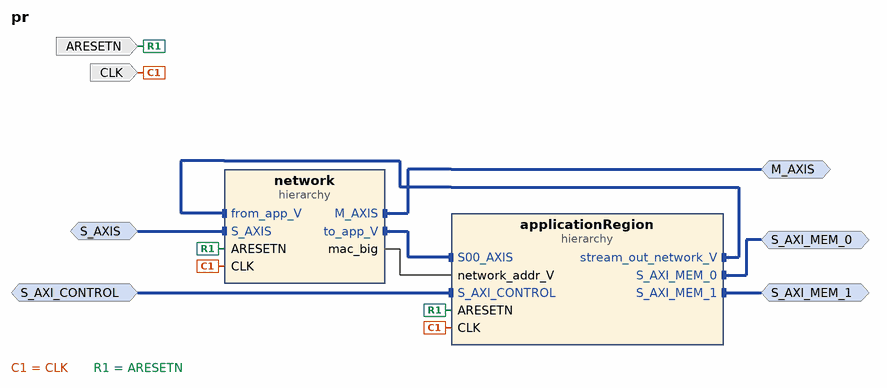
[diagram p0: block diagram of the top level]
# Vivado block design pr, xcku115-flva1517-2-e, Vivado 2018.2
create_bd_design pr

create_bd_intf_port -mode Slave -vlnv xilinx.com:interface:aximm_rtl:1.0 S_AXI_CONTROL
set_property -dict [list \
  CONFIG.DATA_WIDTH 32 \
  CONFIG.PROTOCOL AXI4LITE \
  CONFIG.FREQ_HZ 156250000 \
  CONFIG.ID_WIDTH 0 \
  CONFIG.ADDR_WIDTH 16 \
  CONFIG.AWUSER_WIDTH 0 \
  CONFIG.ARUSER_WIDTH 0 \
  CONFIG.WUSER_WIDTH 0 \
  CONFIG.RUSER_WIDTH 0 \
  CONFIG.BUSER_WIDTH 0 \
  CONFIG.READ_WRITE_MODE READ_WRITE \
  CONFIG.HAS_BURST 1 \
  CONFIG.HAS_LOCK 1 \
  CONFIG.HAS_PROT 1 \
  CONFIG.HAS_CACHE 1 \
  CONFIG.HAS_QOS 0 \
  CONFIG.HAS_REGION 0 \
  CONFIG.HAS_WSTRB 1 \
  CONFIG.HAS_BRESP 1 \
  CONFIG.HAS_RRESP 1 \
  CONFIG.SUPPORTS_NARROW_BURST 0 \
  CONFIG.NUM_READ_OUTSTANDING 2 \
  CONFIG.NUM_WRITE_OUTSTANDING 2 \
  CONFIG.MAX_BURST_LENGTH 1 \
  CONFIG.NUM_READ_THREADS 1 \
  CONFIG.NUM_WRITE_THREADS 1 \
  CONFIG.RUSER_BITS_PER_BYTE 0 \
  CONFIG.WUSER_BITS_PER_BYTE 0 \
] [get_bd_intf_ports S_AXI_CONTROL]
create_bd_intf_port -mode Master -vlnv xilinx.com:interface:aximm_rtl:1.0 S_AXI_MEM_0
set_property -dict [list \
  CONFIG.DATA_WIDTH 512 \
  CONFIG.PROTOCOL AXI4 \
  CONFIG.FREQ_HZ 156250000 \
  CONFIG.ADDR_WIDTH 32 \
  CONFIG.NUM_READ_OUTSTANDING 2 \
  CONFIG.NUM_WRITE_OUTSTANDING 2 \
] [get_bd_intf_ports S_AXI_MEM_0]
create_bd_intf_port -mode Master -vlnv xilinx.com:interface:aximm_rtl:1.0 S_AXI_MEM_1
set_property -dict [list \
  CONFIG.DATA_WIDTH 512 \
  CONFIG.PROTOCOL AXI4 \
  CONFIG.FREQ_HZ 156250000 \
  CONFIG.ADDR_WIDTH 32 \
  CONFIG.NUM_READ_OUTSTANDING 2 \
  CONFIG.NUM_WRITE_OUTSTANDING 2 \
] [get_bd_intf_ports S_AXI_MEM_1]
create_bd_intf_port -mode Slave -vlnv xilinx.com:interface:axis_rtl:1.0 S_AXIS
set_property -dict [list \
  CONFIG.TDATA_NUM_BYTES 8 \
  CONFIG.TDEST_WIDTH 0 \
  CONFIG.TID_WIDTH 0 \
  CONFIG.TUSER_WIDTH 0 \
  CONFIG.HAS_TREADY 1 \
  CONFIG.HAS_TSTRB 0 \
  CONFIG.HAS_TKEEP 1 \
  CONFIG.HAS_TLAST 1 \
  CONFIG.FREQ_HZ 156250000 \
  CONFIG.LAYERED_METADATA undef \
] [get_bd_intf_ports S_AXIS]
create_bd_intf_port -mode Master -vlnv xilinx.com:interface:axis_rtl:1.0 M_AXIS
set_property -dict {CONFIG.FREQ_HZ 156250000} [get_bd_intf_ports M_AXIS]
create_bd_port -dir I -type clk CLK
set_property -dict [list \
  CONFIG.FREQ_HZ 156250000 \
  CONFIG.ASSOCIATED_BUSIF S_AXIS:M_AXIS:S_AXI_CONTROL:S_AXI_MEM_0:S_AXI_MEM_1 \
] [get_bd_ports CLK]
create_bd_port -dir I -type rst ARESETN

create_bd_cell -type hier network
create_bd_cell -type hier applicationRegion

# ---- hierarchy /network ----
current_bd_instance /network
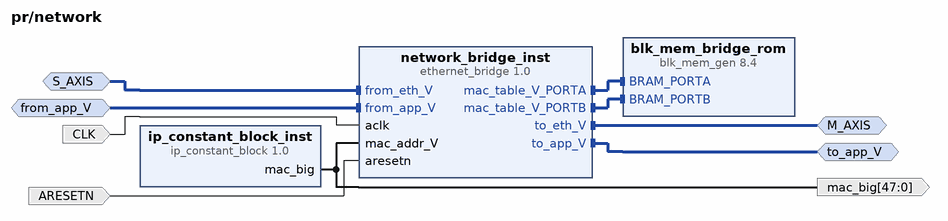
[diagram p1: block diagram inside /network]
create_bd_intf_pin -mode Slave -vlnv xilinx.com:interface:axis_rtl:1.0 S_AXIS
create_bd_intf_pin -mode Master -vlnv xilinx.com:interface:axis_rtl:1.0 M_AXIS
create_bd_intf_pin -mode Slave -vlnv xilinx.com:interface:axis_rtl:1.0 from_app_V
create_bd_intf_pin -mode Master -vlnv xilinx.com:interface:axis_rtl:1.0 to_app_V
create_bd_pin -dir I -type clk CLK
create_bd_pin -dir I -type rst ARESETN
create_bd_pin -dir O -from 47 -to 0 mac_big

create_bd_cell -type ip -vlnv user.org:user:ip_constant_block:1.0 ip_constant_block_inst
set_property -dict [list \
  CONFIG.C_IP_B0 101 \
  CONFIG.C_IP_B1 2 \
  CONFIG.C_IP_B2 1 \
  CONFIG.C_IP_B3 10 \
  CONFIG.C_GATEWAY_B0 100 \
  CONFIG.C_GATEWAY_B1 2 \
  CONFIG.C_GATEWAY_B2 1 \
  CONFIG.C_GATEWAY_B3 10 \
  CONFIG.C_SUBNET_B0 0 \
  CONFIG.C_SUBNET_B1 255 \
  CONFIG.C_SUBNET_B2 255 \
  CONFIG.C_SUBNET_B3 255 \
  CONFIG.C_MAC 0xfa163e55ca02 \
] [get_bd_cells ip_constant_block_inst]
create_bd_cell -type ip -vlnv xilinx.com:hls:ethernet_bridge:1.0 network_bridge_inst
create_bd_cell -type ip -vlnv xilinx.com:ip:blk_mem_gen:8.4 blk_mem_bridge_rom
set_property -dict [list \
  CONFIG.Memory_Type Dual_Port_ROM \
  CONFIG.Enable_32bit_Address true \
  CONFIG.Write_Width_A 64 \
  CONFIG.Write_Width_B 64 \
  CONFIG.Read_Width_B 64 \
  CONFIG.Enable_B Use_ENB_Pin \
  CONFIG.Register_PortA_Output_of_Memory_Primitives false \
  CONFIG.Load_Init_File true \
  CONFIG.Coe_File ../../../../../../../mac.coe \
  CONFIG.Use_RSTA_Pin true \
  CONFIG.Use_RSTB_Pin true \
  CONFIG.Port_A_Write_Rate 0 \
  CONFIG.Port_B_Clock 100 \
  CONFIG.Port_B_Enable_Rate 100 \
  CONFIG.use_bram_block BRAM_Controller \
  CONFIG.EN_SAFETY_CKT true \
] [get_bd_cells blk_mem_bridge_rom]

# ---- hierarchy /applicationRegion ----
current_bd_instance /applicationRegion
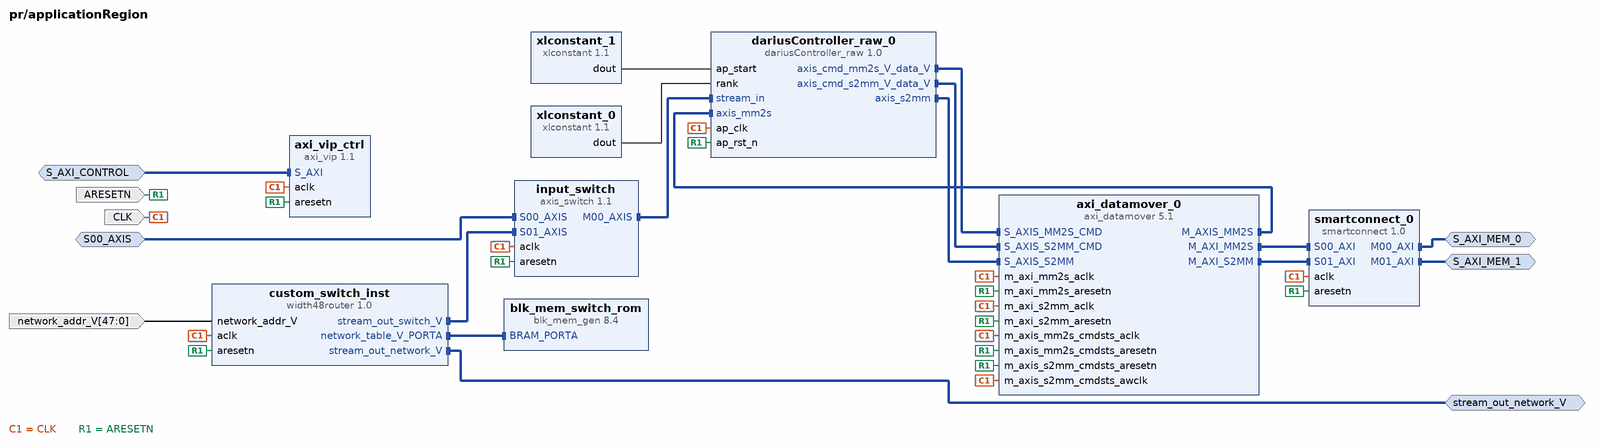
[diagram p2: block diagram inside /applicationRegion]
create_bd_intf_pin -mode Slave -vlnv xilinx.com:interface:aximm_rtl:1.0 S_AXI_CONTROL
create_bd_intf_pin -mode Master -vlnv xilinx.com:interface:aximm_rtl:1.0 S_AXI_MEM_0
create_bd_intf_pin -mode Master -vlnv xilinx.com:interface:aximm_rtl:1.0 S_AXI_MEM_1
create_bd_intf_pin -mode Slave -vlnv xilinx.com:interface:axis_rtl:1.0 S00_AXIS
create_bd_intf_pin -mode Master -vlnv xilinx.com:interface:axis_rtl:1.0 stream_out_network_V
create_bd_pin -dir I -type clk CLK
create_bd_pin -dir I -type rst ARESETN
create_bd_pin -dir I -from 47 -to 0 network_addr_V

create_bd_cell -type ip -vlnv xilinx.com:ip:axi_vip:1.1 axi_vip_ctrl
set_property -dict {CONFIG.PROTOCOL AXI4LITE CONFIG.INTERFACE_MODE SLAVE} [get_bd_cells axi_vip_ctrl]
create_bd_cell -type ip -vlnv xilinx.com:ip:blk_mem_gen:8.4 blk_mem_switch_rom
set_property -dict [list \
  CONFIG.Memory_Type Single_Port_ROM \
  CONFIG.Enable_32bit_Address true \
  CONFIG.Write_Width_A 64 \
  CONFIG.Register_PortA_Output_of_Memory_Primitives false \
  CONFIG.Load_Init_File true \
  CONFIG.Coe_File ../../../../../../../mac.coe \
  CONFIG.Use_RSTA_Pin true \
  CONFIG.Port_A_Write_Rate 0 \
  CONFIG.use_bram_block BRAM_Controller \
  CONFIG.EN_SAFETY_CKT true \
] [get_bd_cells blk_mem_switch_rom]
create_bd_cell -type ip -vlnv xilinx.com:hls:width48router:1.0 custom_switch_inst
create_bd_cell -type ip -vlnv xilinx.com:ip:axis_switch:1.1 input_switch
set_property -dict [list \
  CONFIG.NUM_SI 2 \
  CONFIG.NUM_MI 1 \
  CONFIG.ARB_ON_MAX_XFERS 0 \
  CONFIG.ARB_ON_TLAST 1 \
  CONFIG.M00_AXIS_BASETDEST 0x00000001 \
  CONFIG.M00_AXIS_HIGHTDEST 0x00000001 \
] [get_bd_cells input_switch]
create_bd_cell -type ip -vlnv xilinx.com:ip:axi_datamover:5.1 axi_datamover_0
set_property -dict [list \
  CONFIG.c_m_axi_mm2s_data_width 64 \
  CONFIG.c_m_axis_mm2s_tdata_width 64 \
  CONFIG.c_mm2s_burst_size 8 \
  CONFIG.c_dummy 1 \
] [get_bd_cells axi_datamover_0]
create_bd_cell -type ip -vlnv xilinx.com:ip:xlconstant:1.1 xlconstant_0
set_property -dict {CONFIG.CONST_WIDTH 32 CONFIG.CONST_VAL 0} [get_bd_cells xlconstant_0]
create_bd_cell -type ip -vlnv xilinx.com:ip:xlconstant:1.1 xlconstant_1
create_bd_cell -type ip -vlnv xilinx.com:ip:smartconnect:1.0 smartconnect_0
set_property -dict {CONFIG.NUM_MI 2} [get_bd_cells smartconnect_0]
create_bd_cell -type ip -vlnv xilinx.com:hls:dariusController_raw:1.0 dariusController_raw_0

# ---- connections ----

current_bd_instance /network
connect_bd_intf_net [get_bd_intf_pins network_bridge_inst/mac_table_V_PORTA] [get_bd_intf_pins blk_mem_bridge_rom/BRAM_PORTA]
connect_bd_intf_net [get_bd_intf_pins network_bridge_inst/mac_table_V_PORTB] [get_bd_intf_pins blk_mem_bridge_rom/BRAM_PORTB]
connect_bd_intf_net [get_bd_intf_pins S_AXIS] [get_bd_intf_pins network_bridge_inst/from_eth_V]
connect_bd_intf_net [get_bd_intf_pins M_AXIS] [get_bd_intf_pins network_bridge_inst/to_eth_V]
connect_bd_intf_net [get_bd_intf_pins from_app_V] [get_bd_intf_pins network_bridge_inst/from_app_V]
connect_bd_intf_net [get_bd_intf_pins to_app_V] [get_bd_intf_pins network_bridge_inst/to_app_V]
connect_bd_net [get_bd_pins CLK] [get_bd_pins network_bridge_inst/aclk]
connect_bd_net [get_bd_pins ARESETN] [get_bd_pins network_bridge_inst/aresetn]
connect_bd_net [get_bd_pins ip_constant_block_inst/mac_big] [get_bd_pins network_bridge_inst/mac_addr_V] [get_bd_pins mac_big]

current_bd_instance /applicationRegion
connect_bd_intf_net [get_bd_intf_pins custom_switch_inst/network_table_V_PORTA] [get_bd_intf_pins blk_mem_switch_rom/BRAM_PORTA]
connect_bd_intf_net [get_bd_intf_pins custom_switch_inst/stream_out_switch_V] [get_bd_intf_pins input_switch/S01_AXIS]
connect_bd_intf_net [get_bd_intf_pins axi_datamover_0/M_AXI_MM2S] [get_bd_intf_pins smartconnect_0/S00_AXI]
connect_bd_intf_net [get_bd_intf_pins axi_datamover_0/M_AXI_S2MM] [get_bd_intf_pins smartconnect_0/S01_AXI]
connect_bd_intf_net [get_bd_intf_pins dariusController_raw_0/axis_cmd_mm2s_V_data_V] [get_bd_intf_pins axi_datamover_0/S_AXIS_MM2S_CMD]
connect_bd_intf_net [get_bd_intf_pins dariusController_raw_0/axis_cmd_s2mm_V_data_V] [get_bd_intf_pins axi_datamover_0/S_AXIS_S2MM_CMD]
connect_bd_intf_net [get_bd_intf_pins dariusController_raw_0/axis_s2mm] [get_bd_intf_pins axi_datamover_0/S_AXIS_S2MM]
connect_bd_intf_net [get_bd_intf_pins input_switch/M00_AXIS] [get_bd_intf_pins dariusController_raw_0/stream_in]
connect_bd_intf_net [get_bd_intf_pins axi_datamover_0/M_AXIS_MM2S] [get_bd_intf_pins dariusController_raw_0/axis_mm2s]
connect_bd_intf_net [get_bd_intf_pins S_AXI_CONTROL] [get_bd_intf_pins axi_vip_ctrl/S_AXI]
connect_bd_intf_net [get_bd_intf_pins S_AXI_MEM_0] [get_bd_intf_pins smartconnect_0/M00_AXI]
connect_bd_intf_net [get_bd_intf_pins S_AXI_MEM_1] [get_bd_intf_pins smartconnect_0/M01_AXI]
connect_bd_intf_net [get_bd_intf_pins S00_AXIS] [get_bd_intf_pins input_switch/S00_AXIS]
connect_bd_intf_net [get_bd_intf_pins stream_out_network_V] [get_bd_intf_pins custom_switch_inst/stream_out_network_V]
connect_bd_net [get_bd_pins CLK] \
  [get_bd_pins axi_vip_ctrl/aclk] [get_bd_pins custom_switch_inst/aclk] [get_bd_pins input_switch/aclk] \
  [get_bd_pins axi_datamover_0/m_axi_mm2s_aclk] [get_bd_pins axi_datamover_0/m_axis_mm2s_cmdsts_aclk] \
  [get_bd_pins axi_datamover_0/m_axi_s2mm_aclk] [get_bd_pins axi_datamover_0/m_axis_s2mm_cmdsts_awclk] \
  [get_bd_pins smartconnect_0/aclk] [get_bd_pins dariusController_raw_0/ap_clk]
connect_bd_net [get_bd_pins ARESETN] \
  [get_bd_pins axi_vip_ctrl/aresetn] [get_bd_pins custom_switch_inst/aresetn] [get_bd_pins input_switch/aresetn] \
  [get_bd_pins axi_datamover_0/m_axi_mm2s_aresetn] [get_bd_pins axi_datamover_0/m_axis_mm2s_cmdsts_aresetn] \
  [get_bd_pins axi_datamover_0/m_axi_s2mm_aresetn] [get_bd_pins axi_datamover_0/m_axis_s2mm_cmdsts_aresetn] \
  [get_bd_pins smartconnect_0/aresetn] [get_bd_pins dariusController_raw_0/ap_rst_n]
connect_bd_net [get_bd_pins network_addr_V] [get_bd_pins custom_switch_inst/network_addr_V]
connect_bd_net [get_bd_pins xlconstant_1/dout] [get_bd_pins dariusController_raw_0/ap_start]
connect_bd_net [get_bd_pins xlconstant_0/dout] [get_bd_pins dariusController_raw_0/rank]

current_bd_instance /
connect_bd_intf_net [get_bd_intf_pins network/to_app_V] [get_bd_intf_pins applicationRegion/S00_AXIS]
connect_bd_intf_net [get_bd_intf_pins applicationRegion/stream_out_network_V] [get_bd_intf_pins network/from_app_V]
connect_bd_intf_net [get_bd_intf_ports S_AXI_CONTROL] [get_bd_intf_pins applicationRegion/S_AXI_CONTROL]
connect_bd_intf_net [get_bd_intf_ports S_AXI_MEM_0] [get_bd_intf_pins applicationRegion/S_AXI_MEM_0]
connect_bd_intf_net [get_bd_intf_ports S_AXI_MEM_1] [get_bd_intf_pins applicationRegion/S_AXI_MEM_1]
connect_bd_intf_net [get_bd_intf_ports S_AXIS] [get_bd_intf_pins network/S_AXIS]
connect_bd_intf_net [get_bd_intf_ports M_AXIS] [get_bd_intf_pins network/M_AXIS]
connect_bd_net [get_bd_ports CLK] [get_bd_pins network/CLK] [get_bd_pins applicationRegion/CLK]
connect_bd_net [get_bd_ports ARESETN] [get_bd_pins network/ARESETN] [get_bd_pins applicationRegion/ARESETN]
connect_bd_net [get_bd_pins network/mac_big] [get_bd_pins applicationRegion/network_addr_V]

# ---- address map ----
assign_bd_address -offset 0x00000000 -range 2G -target_address_space [get_bd_addr_spaces applicationRegion/axi_datamover_0/Data_MM2S] [get_bd_addr_segs S_AXI_MEM_0/Reg]
assign_bd_address -offset 0x44A00000 -range 64K -target_address_space [get_bd_addr_spaces applicationRegion/axi_datamover_0/Data_S2MM] [get_bd_addr_segs S_AXI_MEM_0/Reg]
assign_bd_address -offset 0x44A10000 -range 64K -target_address_space [get_bd_addr_spaces applicationRegion/axi_datamover_0/Data_S2MM] [get_bd_addr_segs S_AXI_MEM_1/Reg]
assign_bd_address -offset 0x0000 -range 64K -target_address_space [get_bd_addr_spaces S_AXI_CONTROL] [get_bd_addr_segs applicationRegion/axi_vip_ctrl/S_AXI/Reg]

validate_bd_design
save_bd_design
